# EAGLE design adapter-board-stepper (EAGLE 7.6.0)
ADAPTER-BOARD-STEPPER
AUTHOR: lokies; COMPANY: Max-Planck-Institut für Gravitationsphysik; CREATIONAUTHOR: lokies; CREATIONDATE: 2024-06-26; INFOSETTINGS: Used by 'info.ulp' - do not edit manually! |FileTime=2026-02-24, 15:16:09|FileVersion=2||[FrontMatter]|DocTitle=|SubTitle=|Authors=|Keywords=|Abstract=|LaTeXSyntax=0||[Safety]|VoltageHazard=-1|HeatHazard=-1|Convection=0|ForcedAir=0|WaterCooling=0|LightHazard=-1|LaserPower=1000|LaserWavelength=1064|LaserClass=6|LightPower=1000|LightInvisible=0||[Notes]|Machinery=-1|IntendedUsers=-1|; REVISION: 2024-06-26; TITLE: ADAPTER-BOARD-STEPPER; TITLE1: ADAPTER-BOARD-; TITLE2: STEPPER
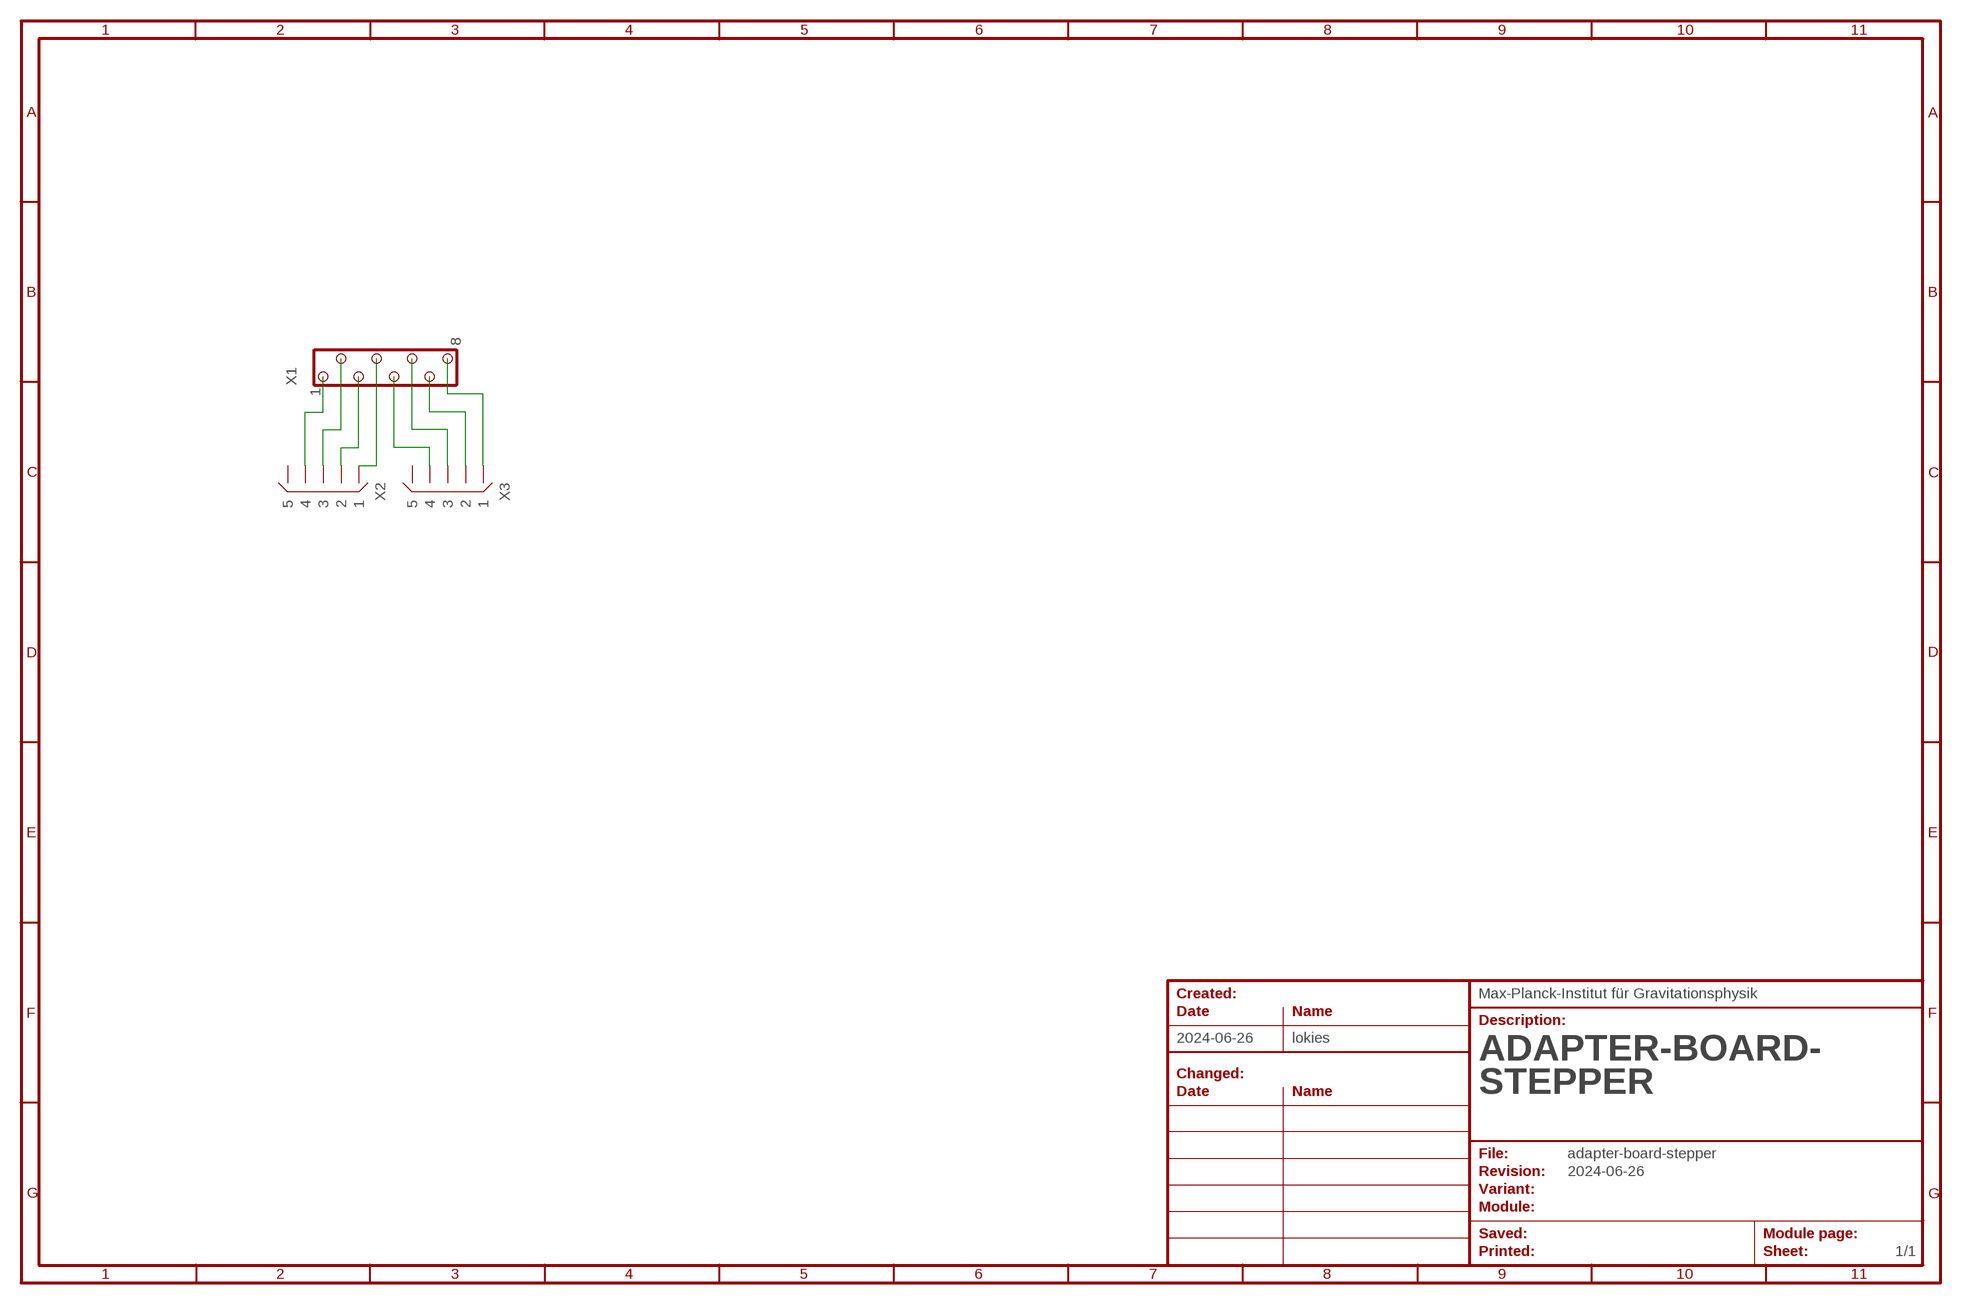
[diagram p0: schematic, sheet 1]
$1 (FRAME-A4-LANDSCAPE): SPICE: <ignore>

## Parts
X1  XS08-RJ45  [XS08-2S-RJ45]
X2  X05-SIL-MALE-VERT-L  [X05-SIL-MALE-VERT-L]
X3  X05-SIL-MALE-VERT-L  [X05-SIL-MALE-VERT-L]

## Nets
N$1: X1.4 X2.1
N$2: X1.3 X2.2
N$3: X1.2 X2.3
N$4: X1.1 X2.4
N$5: X1.5 X3.4
N$6: X1.6 X3.3
N$7: X1.7 X3.2
N$8: X1.8 X3.1
Unconnected: X1.GND1(CASE) X1.GND2(CASE) X2.5 X3.5

## Library data of the parts
X1 = connectors:XS08: Shielded connector, 8 pins, 2 shield pins; IGNOREVALUE: 1; SPICE: <ignore>
X2 X3 = connectors:X05: Connector 5 pins; IGNOREVALUE: 1; SPICE: <ignore>

## Board
ADAPTER-BOARD-STEPPER
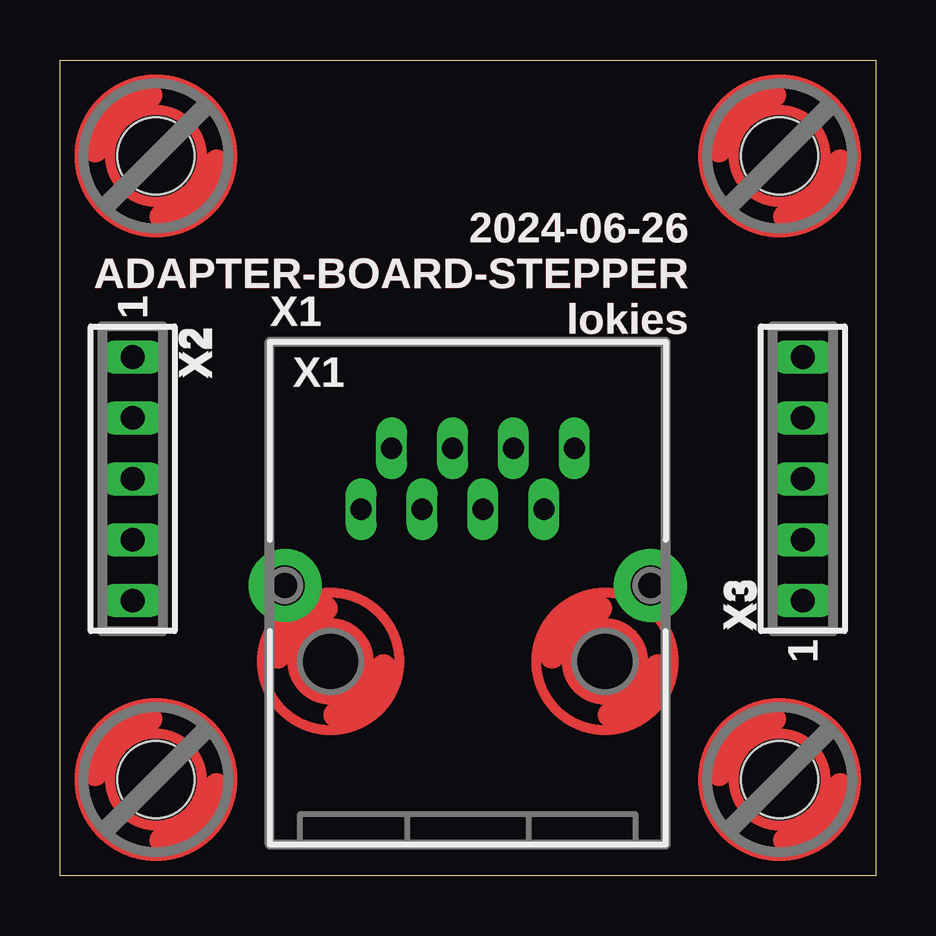
[diagram p1: board, top side]
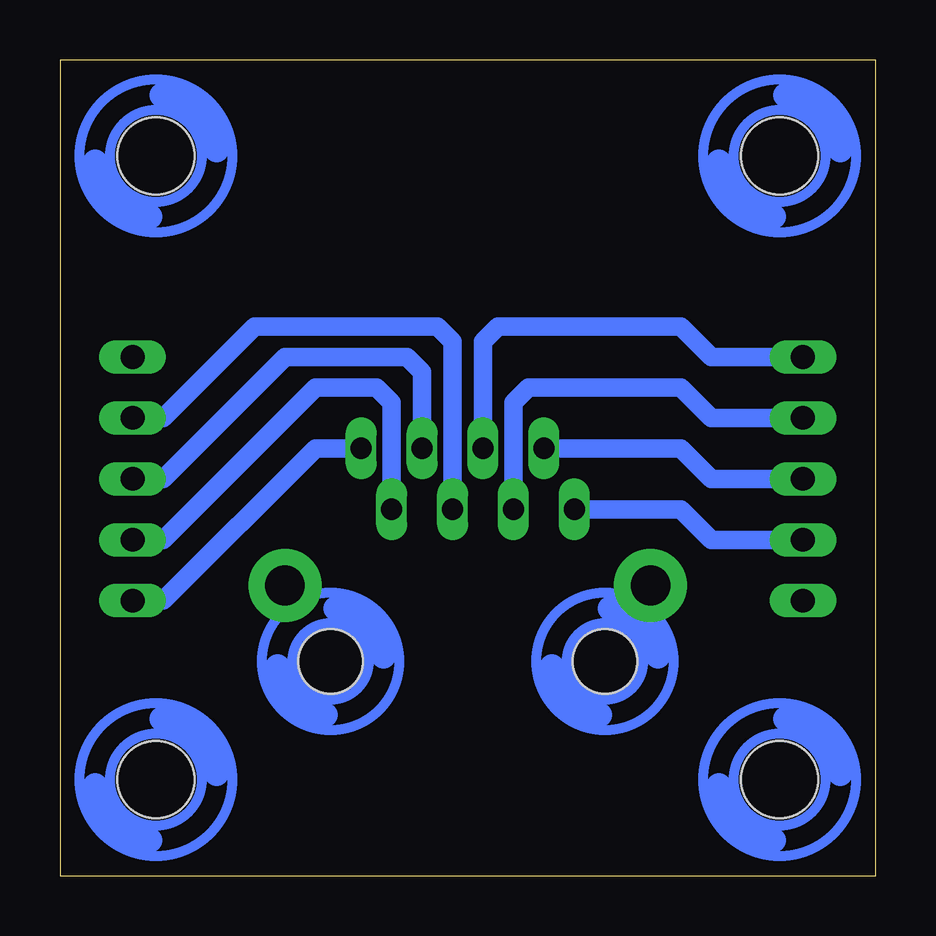
[diagram p2: board, bottom side, seen from below]

Size 34 x 34 mm. Coordinates in mm from the lower left corner, seen from the top.
Outline: 0,0 0,34 34,34 34,0 0,0
Copper layers (1*16): Top 0.035mm / dielectric 1.5mm / Bottom 0.035mm
Design rules "doublesided-inhouse": minimum track width 0.2mm, minimum drill 0.8mm, track to track 0.2mm, track to pad 0.2mm, pad to pad 0.2mm, via to via 0.2mm, smd to smd 0mil, copper to edge 0.5mm, drill to drill 0.4mm, minimum pad ring 0.2mm, minimum via ring 0.2mm, stop-mask expansion 0.05mm, vias tented up to drill 0mil, thermal gap 0.2mm

### Footprints (pad centres in the part's own frame; a part is rotated, then mirrored left to right if it is on the bottom)
SCREW-3 = hole 3.2: 0,0
XS08-2S-RJ45 = drill 0.889 pad 1.27 long: 1 -4.445,-1.27; 2 -3.175,1.27; 3 -1.905,-1.27; 4 -0.635,1.27; 5 0.635,-1.27; 6 1.905,1.27; 7 3.175,-1.27; 8 4.445,1.27 | drill 1.651 pad 3.048: GND1 -7.62,-4.445; GND2 7.62,-4.445 | hole 2.692: -5.715,-7.62; 5.715,-7.62
X05-SIL-MALE-VERT-L = drill 0.991 pad 1.397 long: 1 -5.08,0; 2 -2.54,0; 3 0,0; 4 2.54,0; 5 5.08,0

### Placement (x,y rotation side)
U$1  [SCREW-3]  4,4 0 top
U$2  [INFO-SMALL]  26.21,25.11 180 top
U$3  [SCREW-3]  30,4 0 top
U$4  [SCREW-3]  30,30 0 top
U$5  [SCREW-3]  4,30 0 top
X1  17,16.54 0 top
X2  3.03,16.54 270 top
X3  30.97,16.54 90 top

### Tracks (layer width: path | path; a pad name or v marks a point on that pad's centre or on a via)
N$1
  Bottom 0.762: X2.1 6.84,21.62 8.11,22.89 15.73,22.89 16.36,22.26 X1.4
N$2
  Bottom 0.762: X2.2 6.84,19.08 8.11,20.35 14.46,20.35 15.1,19.71 X1.3
N$3
  Bottom 0.762: X2.3 6.84,16.54 8.11,17.81 X1.2
N$4
  Bottom 0.762: X2.4 6.84,14 8.11,15.27 X1.1
N$5
  Bottom 0.762: X3.4 29.7,19.08 25.89,22.89 18.27,22.89 17.64,22.26 X1.5
N$6
  Bottom 0.762: X3.3 29.7,16.54 24.62,21.62 19.54,21.62 18.91,20.98 X1.6
N$7
  Bottom 0.762: X3.2 29.7,14 23.35,20.35 20.81,20.35 20.18,19.71 X1.7
N$8
  Bottom 0.762: X3.1 29.7,11.46 23.35,17.81 X1.8